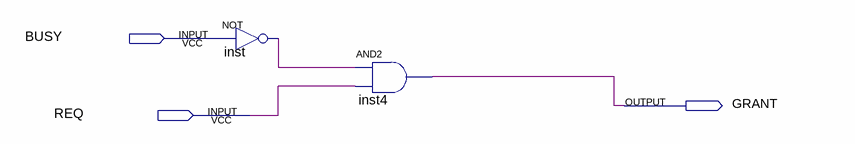
[diagram p0: schematic sheet]
// Quartus schematic arbitr.bdf as structural Verilog: 2 symbols, 3 pins
module arbitr (
  input  BUSY,
  input  REQ,
  output GRANT
);

  wire inst_out;

  not inst (inst_out, BUSY);
  and inst4 (GRANT, inst_out, REQ);
endmodule
